# Altium schematic sheet Components.SchDoc
size A; SheetNumber: 3; SheetTotal: 3
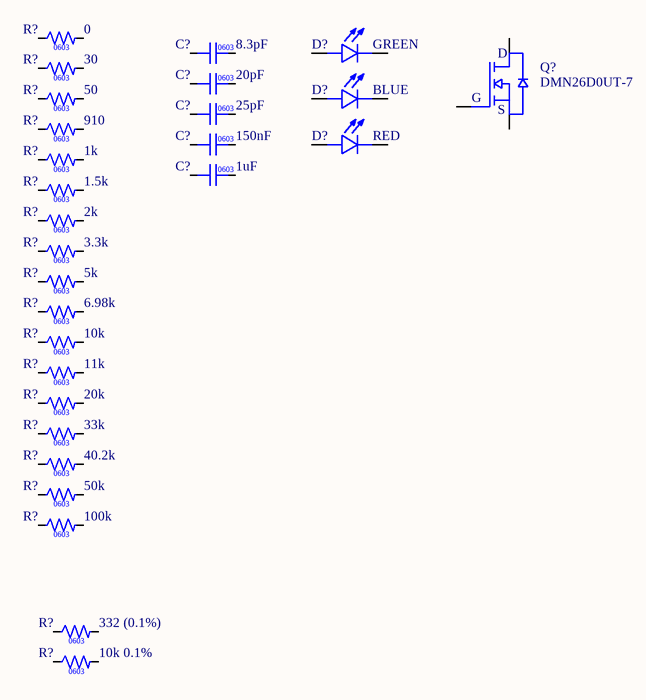
[diagram p0: Components.SchDoc]

## Parts
(Parts that share a designator on the sheet are numbered #1, #2 ... from top to bottom, then left to right.)
C?#1  8.3pF  [CAP_0603]
C?#2  20pF  [CAP_0603]
C?#3  25pF  [CAP_0603]
C?#4  150nF  [CAP_0603]
C?#5  1uF  [CAP_0603]
D?#1  GREEN  [LED_0603]
D?#2  BLUE  [LED_0603]
D?#3  RED  [LED_0603]
Q?  MFG_PN: DMN26D0UT-7  [SOT-523_NMOS]  (hidden comment: NMOS)
R?#1  0  [RES_0603]
R?#2  30  [RES_0603]
R?#3  50  [RES_0603]
R?#4  910  [RES_0603]
R?#5  1k  [RES_0603]
R?#6  1.5k  [RES_0603]
R?#7  2k  [RES_0603]
R?#8  3.3k  [RES_0603]
R?#9  5k  [RES_0603]
R?#10  6.98k  [RES_0603]
R?#11  10k  [RES_0603]
R?#12  11k
R?#13  20k  [RES_0603]
R?#14  33k
R?#15  40.2k  [RES_0603]
R?#16  50k  [RES_0603]
R?#17  100k
R?#18  332 (0.1%)  [RES_0603]
R?#19  10k 0.1%  [RES_0603]

## Nets

Not connected (* = marked no-connect by the designer): C?#1 1 2; C?#2 1 2; C?#3 1 2; C?#4 1 2; C?#5 1 2; D?#1 A C; D?#2 A C; D?#3 A C; Q? D(Drain) G(Gate) S(Source); R?#1 1 2; R?#2 1 2; R?#3 1 2; R?#4 1 2; R?#5 1 2; R?#6 1 2; R?#7 1 2; R?#8 1 2; R?#9 1 2; R?#10 1 2; R?#11 1 2; R?#12 1 2; R?#13 1 2; R?#14 1 2; R?#15 1 2; R?#16 1 2; R?#17 1 2; R?#18 1 2; R?#19 1 2

## Notes on the sheet
- (in symbol CAP_0603) 0603
- (in symbol RES_0603) 0603

## Library data of the parts
C?#1 = CAP_0603: MFG: KEMET; MFG_PN: CBR06C839B5GAC; DIST: Digikey; DIST_PN: 399-16261-1-ND; MSL: 1; LINK: https://www.digikey.com/en/products/detail/kemet/CBR06C839B5GAC/7649567
C?#2 = CAP_0603: MFG: YAGEO; MFG_PN: CC0603JRNPO9BN200; DIST: Digikey; DIST_PN: 311-1424-1-ND; MSL: 1; LINK: https://www.digikey.com/en/products/detail/yageo/CC0603JRNPO9BN200/2833589
C?#3 = CAP_0603: MFG: YAGEO; MFG_PN: CC0603JRNPO9BN250; DIST: Digikey; DIST_PN: 311-3966-1-ND; MSL: 1; LINK: https://www.digikey.com/en/products/detail/yageo/CC0603JRNPO9BN250/5883609
C?#4 = CAP_0603: MFG: YAGEO; MFG_PN: CC0603JRX7R9BB154; DIST: Digikey; DIST_PN: 13-CC0603JRX7R9BB154CT-ND; MSL: 1; LINK: https://www.digikey.com/en/products/detail/yageo/CC0603JRX7R9BB154/11490777
C?#5 = CAP_0603: MFG: YAGEO; MFG_PN: CC0603KRX7R7BB105; DIST: Digikey; DIST_PN: 311-1446-1-ND; MSL: 1; LINK: https://www.digikey.com/en/products/detail/yageo/CC0603KRX7R7BB105/28336112
D?#1 = LED: Green 570nm LED Indication - Discrete 2V 0603 (1608 Metric); MFG: Wurth Elektronik; MFG_PN: 150060VS75000; DIST: Digikey; DIST_PN: 732-4980-1-ND; MSL: 3; LINK: https://www.digikey.com/en/products/detail/w%C3%BCrth-elektronik/150060VS75000/4489906; SuppliersPartNumber: *
D?#2 = LED: Blue 470nm LED Indication - Discrete 3.2V 0603 (1608 Metric) (2.7V @ 2.5mA); MFG: Wurth Elektronik; MFG_PN: 150060BS75000; DIST: Digikey; DIST_PN: 732-4966-1-ND; MSL: 3; LINK: https://www.digikey.com/en/products/detail/w%C3%BCrth-elektronik/150060BS75000/4489895; SuppliersPartNumber: *
D?#3 = LED: Red 625nm LED Indication - Discrete 2V 0603 (1608 Metric); MFG: Wurth Elektronik; MFG_PN: 150060RS75000; DIST: Digikey; DIST_PN: 732-4978-1-ND; MSL: 3; LINK: https://www.digikey.com/en/products/detail/w%C3%BCrth-elektronik/150060RS75000/4489901; SuppliersPartNumber: *
Q? = NMOS: N-Channel 20 V 230mA (Ta) 300mW (Ta) Surface Mount SOT-523; MFG: Diodes Incorporated; DIST: Digikey; DIST_PN: DMN26D0UT-7DICT-ND; MSL: 1; LINK: https://www.digikey.com/en/products/detail/diodes-incorporated/DMN26D0UT-7/2182564; SuppliersPartNumber: *
R?#1 = RES_0603: MFG: YAGEO; MFG_PN: RC0603FR-070RL; DIST: Digikey; DIST_PN: 311-0.0HRCT-ND; MSL: 1; LINK: https://www.digikey.com/en/products/detail/yageo/RC0603FR-070RL/1304008
R?#2 = RES_0603: MFG: AC0603FR-0730RL; MFG_PN: 13-AC0603FR-0730RLCT-ND; DIST: Digikey; DIST_PN: 13-AC0603FR-0730RLCT-ND; MSL: 1; LINK: https://www.digikey.com/en/products/detail/yageo/AC0603FR-0730RL/5896028
R?#3 = RES_0603: MFG: YAGEO; MFG_PN: RC0603FR-0749R9L; DIST: Digikey; DIST_PN: 311-49.9HRCT-ND; MSL: 1; LINK: https://www.digikey.com/en/products/detail/yageo/RC0603FR-0749R9L/727264
R?#4 = RES_0603: MFG: YAGEO; MFG_PN: RC0603FR-07910RL; DIST: Digikey; DIST_PN: 311-910HRCT-ND; MSL: 1; LINK: https://www.digikey.com/en/products/detail/yageo/RC0603FR-07910RL/727429
R?#5 = RES_0603: MFG: YAGEO; MFG_PN: RC0603FR-071KL; DIST: Digikey; DIST_PN: 311-1.00KHRCT-ND; MSL: 1; LINK: https://www.digikey.com/en/products/detail/yageo/RC0603FR-071KL/726843
R?#6 = RES_0603: MFG: YAGEO; MFG_PN: RC0603FR-071K5L; DIST: Digikey; DIST_PN: 311-1.50KHRCT-ND; MSL: 1; LINK: https://www.digikey.com/en/products/detail/yageo/RC0603FR-071K5L/726864
R?#7 = RES_0603: MFG: YAGEO; MFG_PN: RC0603FR-072KL; DIST: Digikey; DIST_PN: 311-2.00KHRCT-ND; MSL: 1; LINK: https://www.digikey.com/en/products/detail/yageo/RC0603FR-072KL/727009?s=N4IgTCBcDaIEoGEAMA2JBmAYnAtEg7GANIAyIAugL5A
R?#8 = RES_0603: MFG: YAGEO; MFG_PN: RC0603FR-073K3L; DIST: Digikey; DIST_PN: 311-3.30KHRCT-ND; MSL: 1; LINK: https://www.digikey.com/en/products/detail/yageo/RC0603FR-073K3L/727126
R?#9 = RES_0603: MFG: YAGEO; MFG_PN: RC0603FR-074K99L; DIST: Digikey; DIST_PN: 311-4.99KHRCT-ND; MSL: 1; LINK: https://www.digikey.com/en/products/detail/yageo/RC0603FR-074K99L/727219
R?#10 = RES_0603: MFG: YAGEO; MFG_PN: RC0603FR-076K98L; DIST: Digikey; DIST_PN: 311-6.98KHRCT-ND; MSL: 1; LINK: https://www.digikey.com/en/products/detail/yageo/RC0603FR-076K98L/727326
R?#11 = RES_0603: MFG: YAGEO; MFG_PN: RC0603FR-0710KL; DIST: Digikey; DIST_PN: 311-10.0KHRCT-ND; MSL: 1; LINK: https://www.digikey.com/en/products/detail/yageo/RC0603FR-0710KL/726880
R?#12 = RES_0603: MFG: YAGEO; MFG_PN: RC0603FR-0711KL; DIST: Digikey; DIST_PN: 311-11.0KHRCT-ND; MSL: 1; LINK: https://www.digikey.com/en/products/detail/yageo/RC0603FR-0711KL/726897
R?#13 = RES_0603: MFG: YAGEO; MFG_PN: RC0603FR-0720KL; DIST: Digikey; DIST_PN: 311-20.0KHRCT-ND; MSL: 1; LINK: https://www.digikey.com/en/products/detail/yageo/RC0603FR-0720KL/727040
R?#14 = RES_0603: MFG: YAGEO; MFG_PN: RC0603FR-0733KL; DIST: Digikey; DIST_PN: 311-33.0KHRCT-ND; MSL: 1; LINK: https://www.digikey.com/en/products/detail/yageo/RC0603FR-0733KL/727159
R?#15 = RES_0603: MFG: YAGEO; MFG_PN: RC0603FR-0740K2L; DIST: Digikey; DIST_PN: 311-40.2KHRCT-ND; MSL: 1; LINK: https://www.digikey.com/en/products/detail/yageo/RC0603FR-0740K2L/727221
R?#16 = RES_0603: MFG: YAGEO; MFG_PN: RC0603FR-0749K9L; DIST: Digikey; DIST_PN: 311-49.9KHRCT-ND; MSL: 1; LINK: https://www.digikey.com/en/products/detail/yageo/RC0603FR-0749K9L/727265
R?#17 = RES_0603: MFG: YAGEO; MFG_PN: RC0603FR-07100KL; DIST: Digikey; DIST_PN: 311-100KHRCT-ND; MSL: 1; LINK: https://www.digikey.com/en/products/detail/yageo/RC0603FR-07100KL/726889
R?#18 = RES_0603: MFG: Panasonic; MFG_PN: ERA-3AEB3320V; DIST: Digikey; DIST_PN: P332DBCT-ND; MSL: 1; LINK: https://www.digikey.com/en/products/detail/panasonic-electronic-components/ERA-3AEB3320V/2026704
R?#19 = RES_0603: MFG: YAGEO; MFG_PN: RT0603BRD0710KL; DIST: Digikey; DIST_PN: YAG1236CT-ND; MSL: 1; LINK: https://www.digikey.com/en/products/detail/yageo/RT0603BRD0710KL/1072198